# Altium schematic sheet vertap.SchDoc
size 381 x 241 mm; SheetNumber: 1; SheetTotal: 1
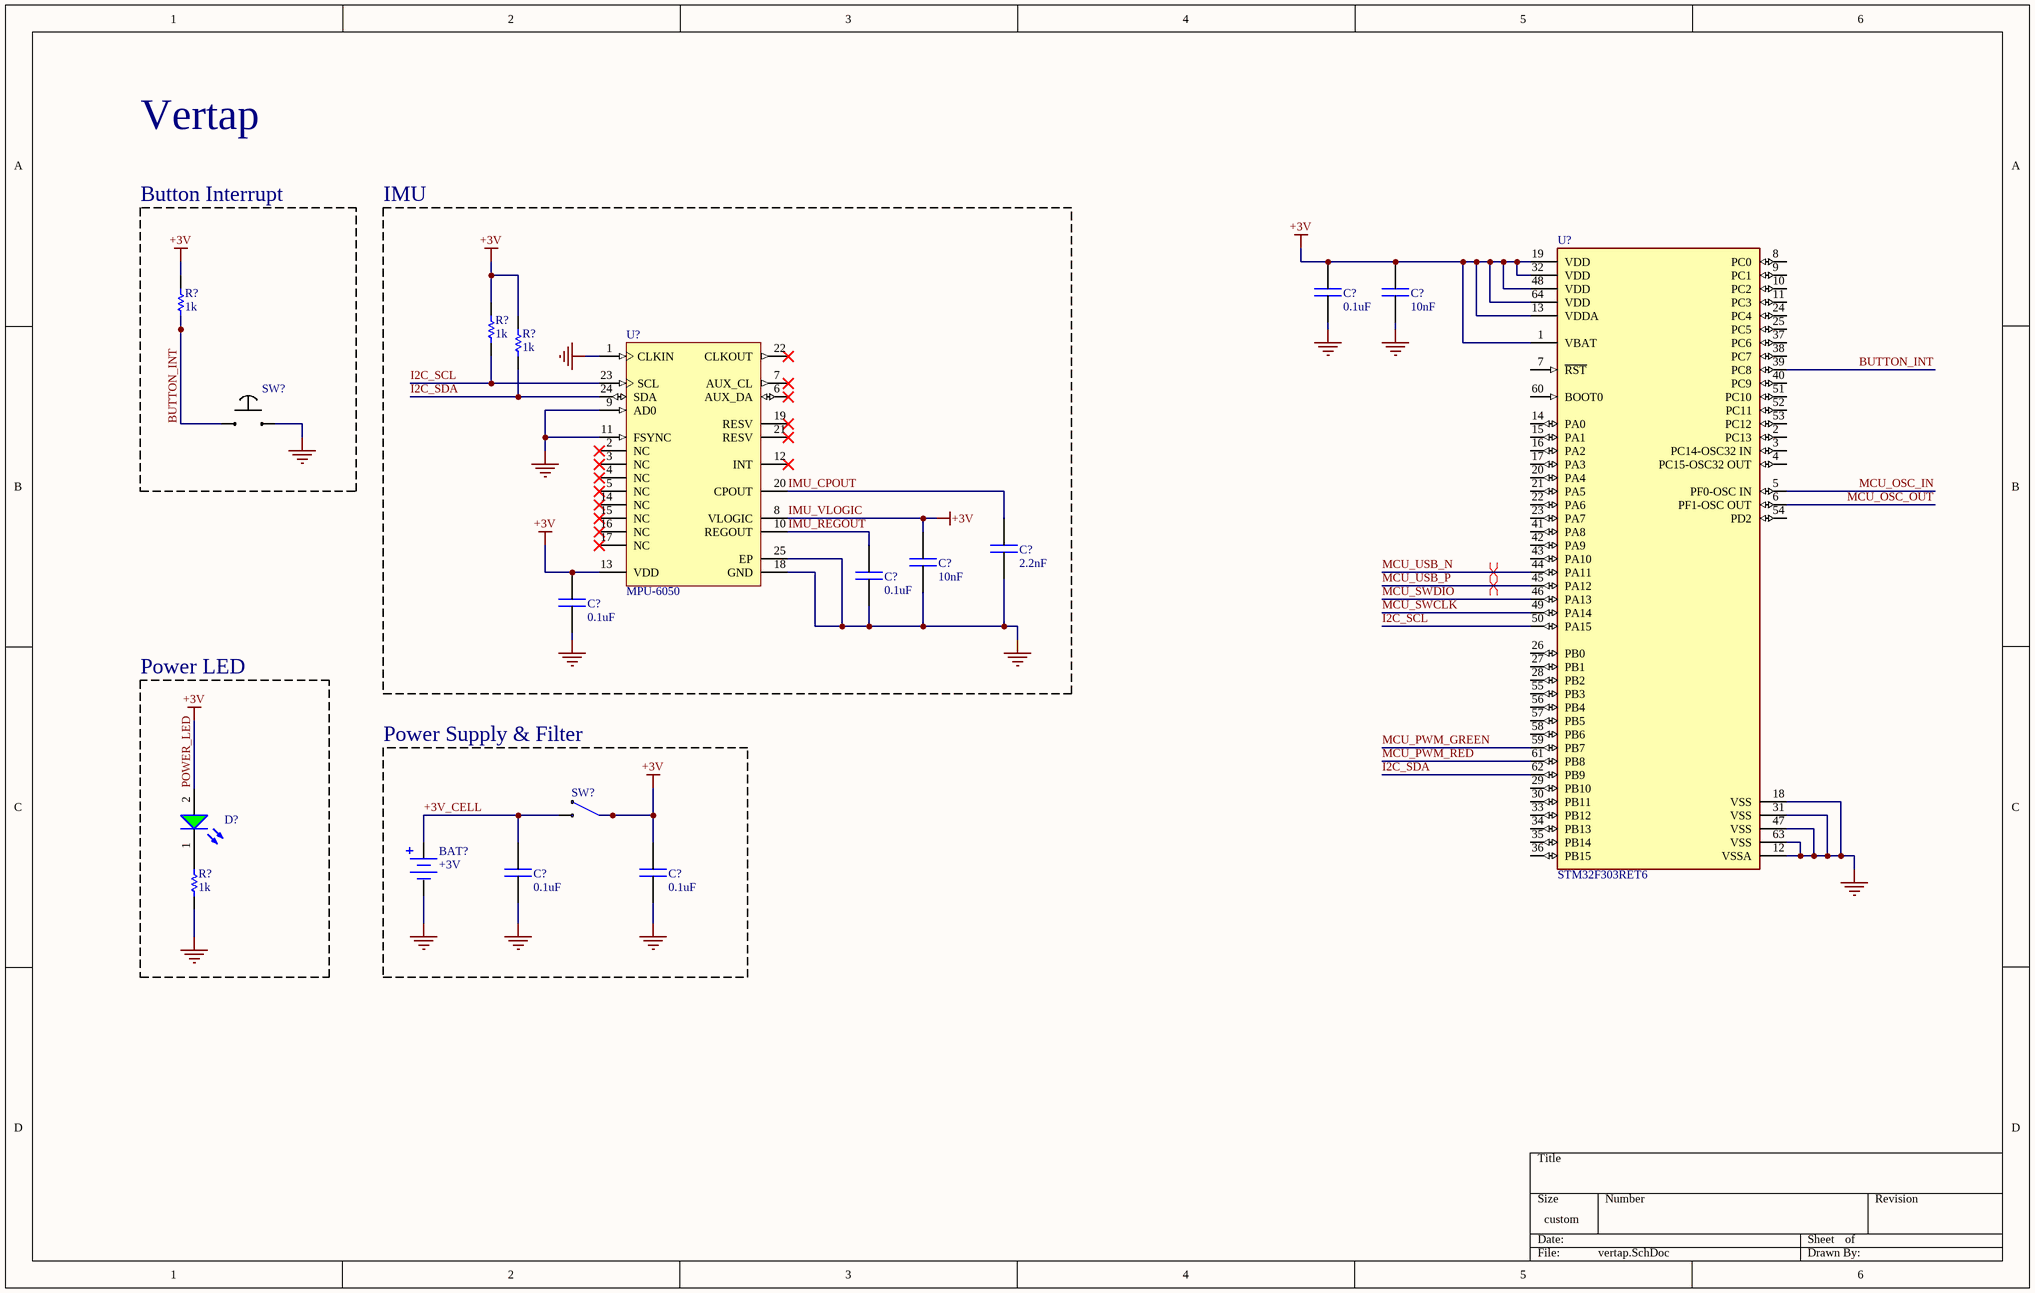
[diagram p0: vertap.SchDoc]

## Parts
(Parts that share a designator on the sheet are numbered #1, #2 ... from top to bottom, then left to right.)
BAT?  +3V
C?#1  0.1uF
C?#2  10nF
C?#3  2.2nF
C?#4  10nF
C?#5  0.1uF
C?#6  0.1uF
C?#7  0.1uF
C?#8  0.1uF
D?  150060VS75000  [WL-SMCW_0603_150060xx75000]  (value not drawn)
R?#1  1k  [RESC1608X55X25LL10T15]
R?#2  1k  [RESC1608X55X25LL10T15]
R?#3  1k  [RESC1608X55X25LL10T15]
R?#4  1k  [RESC1608X55X25LL10T15]
SW?#1  Momentary Button  (value not drawn)
SW?#2  C1700ROAAA  (value not drawn)
U?#1  STM32F303RET6  [FP-LQFP64-5W-MFG]
U?#2  MPU-6050  [IS-QFN-24_V]

## Blocks framed on the sheet
Button Interrupt: R?#1 SW?#1
IMU: C?#3-C?#6 R?#2 R?#3 U?#2
Power LED: D? R?#4
Power Supply & Filter: BAT? C?#7 C?#8 SW?#2

## Nets
GND: BAT?.1(-) C?#1.2 C?#2.2 C?#3.2 C?#4.2 C?#5.2 C?#6.2 C?#7.2 C?#8.2 R?#4.1 SW?#1.1 U?#1.12(VSSA) U?#1.18(VSS) U?#1.31(VSS) U?#1.47(VSS) U?#1.63(VSS) U?#2.1(CLKIN) U?#2.9(AD0) U?#2.11(FSYNC) U?#2.18(GND) U?#2.25(EP)
IMU_VLOGIC: C?#1.1 C?#2.1 C?#4.1 C?#6.1 C?#8.1 D?.2(A) R?#1.2 R?#2.2 R?#3.2 SW?#2.2 U?#1.1(VBAT) U?#1.13(VDDA) U?#1.19(VDD) U?#1.32(VDD) U?#1.48(VDD) U?#1.64(VDD) U?#2.8(VLOGIC) U?#2.13(VDD)  [also labelled +3V, POWER_LED]
+3V_CELL: BAT?.2(+) C?#7.1 SW?#2.1
BUTTON_INT: R?#1.1 SW?#1.0 U?#1.39(PC8)
I2C_SCL: R?#2.1 U?#1.50(PA15) U?#2.23(SCL)
I2C_SDA: R?#3.1 U?#1.62(PB9) U?#2.24(SDA)
IMU_CPOUT: C?#3.1 U?#2.20(CPOUT)
IMU_REGOUT: C?#5.1 U?#2.10(REGOUT)
MCU_OSC_IN: U?#1.5(PF0-OSC_IN)
MCU_OSC_OUT: U?#1.6(PF1-OSC_OUT)
MCU_PWM_GREEN: U?#1.59(PB7)
MCU_PWM_RED: U?#1.61(PB8)
MCU_SWCLK: U?#1.49(PA14)
MCU_SWDIO: U?#1.46(PA13)
MCU_USB_N: U?#1.44(PA11)
MCU_USB_P: U?#1.45(PA12)
NetD?_1: D?.1(K) R?#4.2

Not connected (* = marked no-connect by the designer): U?#1 2(PC13) 3(PC14-OSC32_IN) 4(PC15-OSC32_OUT) 7(~{RST}) 8(PC0) 9(PC1) 10(PC2) 11(PC3) 14(PA0) 15(PA1) 16(PA2) 17(PA3) 20(PA4) 21(PA5) 22(PA6) 23(PA7) 24(PC4) 25(PC5) 26(PB0) 27(PB1) 28(PB2) 29(PB10) 30(PB11) 33(PB12) 34(PB13) 35(PB14) 36(PB15) 37(PC6) 38(PC7) 40(PC9) 41(PA8) 42(PA9) 43(PA10) 51(PC10) 52(PC11) 53(PC12) 54(PD2) 55(PB3) 56(PB4) 57(PB5) 58(PB6) 60(BOOT0); U?#2 2(NC)* 3(NC)* 4(NC)* 5(NC)* 6(AUX_DA)* 7(AUX_CL)* 12(INT)* 14(NC)* 15(NC)* 16(NC)* 17(NC)* 19(RESV)* 21(RESV)* 22(CLKOUT)*

## Layout directives
differential pair: MCU_USB_N, MCU_USB_P

## Notes on the sheet
- Vertap

## Library data of the parts
BAT? = BH-67D-5: BATT RETAINER COIN 20MM 1CEL SMD; Supplier 1: Digi-Key; Supplier Part Number 1: 2057-BH-67D-5-ND
C?#1 C?#5-C?#8 = CAP_0.1uF_0603: CAP CER 0.1UF 50V X7R 0603; Supplier 1: Mouser; Supplier Part Number 1: 81-GCM188R71H104JA7D
C?#2 C?#4 = CAP_10nF_0603: CAP CER 10000PF 100V X7R 0603; Supplier 1: Arrow Electronics; Supplier Part Number 1: GCM188R72A103KA37J
C?#3 = CAP_2.2nF_0603: 2200 pF ±20% 50V Ceramic Capacitor X7R 0603 (1608 Metric); Supplier 1: Mouser; Supplier Part Number 1: 81-GCD188R71H222MA1D
D? = CMP-1426-00006-6: NexarPartId: 29717778; Reverse Voltage: 5V; Forward Voltage: 2V; Viewing Angle: 140°; Luminous Intensity: 40mcd; Test Current: 20mA; Max Junction Temperature (Tj): 95°C; Wavelength: 570nm; Forward Current: 100mA; Color: Green; Lens Style: Clear, Rectangular; Power Dissipation: 72mW; Peak Wavelength: 572nm; Packaging: Tape and Reel; REACH SVHC: Unknown; Width: 800µm; Max Operating Temperature: 85°C; Number of Pins: 2; RoHS: Compliant; Dominant Wavelength: 570nm; Min Operating Temperature: -40°C; Case Code (Imperial): 0603; Height: 700µm; Length: 1.6mm; Case Code (Metric): 1608; Case/Package: 0603; Max Reverse Voltage (DC): 5V; Mount: Surface Mount
R?#1-R?#4 = CMP-2000-04305-1: Manufacturer: Yageo; Part Number: RC0603JR-101KL
SW?#1 = NCA2: SWITCH PB SPST-NO 25MA 50V; Manufacturer 1: CIT Relay and Switch; Supplier 1: Digi-Key; Supplier Part Number 1: 2449-NCA2-ND; Manufacturer Part Number 1: NCA2
SW?#2 = C1700ROAAA: SWITCH TOGGLE ON-OFF; Supplier 1: Mouser; Supplier Part Number 1: 167-C1700ROAAA
U?#1 = CMP-0537-00048-2: IC MCU 32BIT 512KB FLASH 64LQFP; Manufacturer: STMicroelectronics; Data Bus Width: 32bits; Standoff Height: 0.05mm; Number Of Pwm Channels: 31; Number Of Timers/Counters: 6; Min Supply Voltage: 2V; Number Of Spi Channels: 4; Core Architecture: ARM Cortex-M4; Number Of I2C Channels: 3; Number Of Usb Channels: 1; Max Supply Voltage: 3.6V; Interface: I2C,SPI,UART,USART,CAN,USB,LIN,IrDA,I2S; Frequency: 72MHz; Max Junction Temp: +105°C; Number Of Uart Channels: 2; Number Of I/Os: 26; Memory Size: 512KBytes; Number Of Adc Channels: 22; Ram Size: 80KBytes; Nominal Supply Current: 4.27-66.4mA; ComponentLink2URL: https://www.st.com/resource/en/datasheet/stm32f303re.pdf; Automotive: No; Mouser Description: MCU 32-Bit STM32 ARM Cortex M4 RISC 512KB Flash 2.5V/3.3V 64-Pin LQFP Tray; Memory Type: FLASH; Temperature: -40°C to +105°C; Temperature Range Low: -40°C; Manufacturer Part Number: STM32F303RET6; Number Of A/D Converters: 4; Ambient Temperature Range High: +85°C; RoHS: TRUE; Category: IC; Ambient Temperature Range Low: -40°C; Number Of Cores: 1; Octopart: https://octopart.com/stm32f303ret6-stmicroelectronics-53115257; Height: 1.6mm; Device Class L2: Embedded Processors and Controllers; Device Class L3: Microcontrollers; Temperature Range High: +105°C; ComponentLink2Description: Datasheet; Lead Free: Yes; Digikey Description: IC MCU 32BIT 512KB FLASH 64LQFP; Package: LQFP64-5W; Device Class L1: Integrated Circuits (ICs)
U?#2 = CMP-1753-00002-2: 3-Axis Gyroscope, Accelerometer and a Digital Motion Processor(TM) (DMP), 2.375 to 3.46 V, -40 to 85 degC, 24-Pin QFN, RoHS, Tape and Reel; Manufacturer: InvenSense; Featured Product: MPU-60506-Axis,IntegratedI²CSolution; Other Names: 1428-1007-2 / MPU6050; Sensor Type: MotionTracking; Online Catalog: MPU-6000™Series; Unit PriceUSD: Digital; Datasheet Version: Rev. 3.3, 05/2012; Category: Sensors,Transducers; Datasheet URL: http://datasheet.octopart.com/MPU-6050-InvenSense-datasheet-14421344.pdf; Family: Multifunction; Standard Package: 5,000; Manufacturer URL: http://www.invensense.com/; Output Type: Digital; Dynamic Catalog: MPU-6000™Series